# Altium schematic sheet MCU025B_Connectors.SchDoc
size 431 x 279 mm; PageSetup: Record=PageOptions|CenterHorizontal=True|CenterVertical=True|PrintScale=1.00|XCorrection=1.00|YCorrection=1.00|PrintKind=0|BorderSize=5000000|LeftOffset=0|BottomOffset=0|Orientation=2|PaperLength=1000|PaperWidth=1000|Scale=100|PaperSource=15|PrintQuality=600|MediaType=1|DitherType=10|PaperKind=Letter|PrintScaleMode=1; Organization: ORGANIZATION; Address1: ADDRESS 1; Address2: ADDRESS 2; Address3: ADDRESS 3; Address4: ADDRESS 4; Revision: -; ENG_APP_DATE: --/--/--; DSN_APP_DATE: --/--/--; CHK_APP_DATE: --/--/--
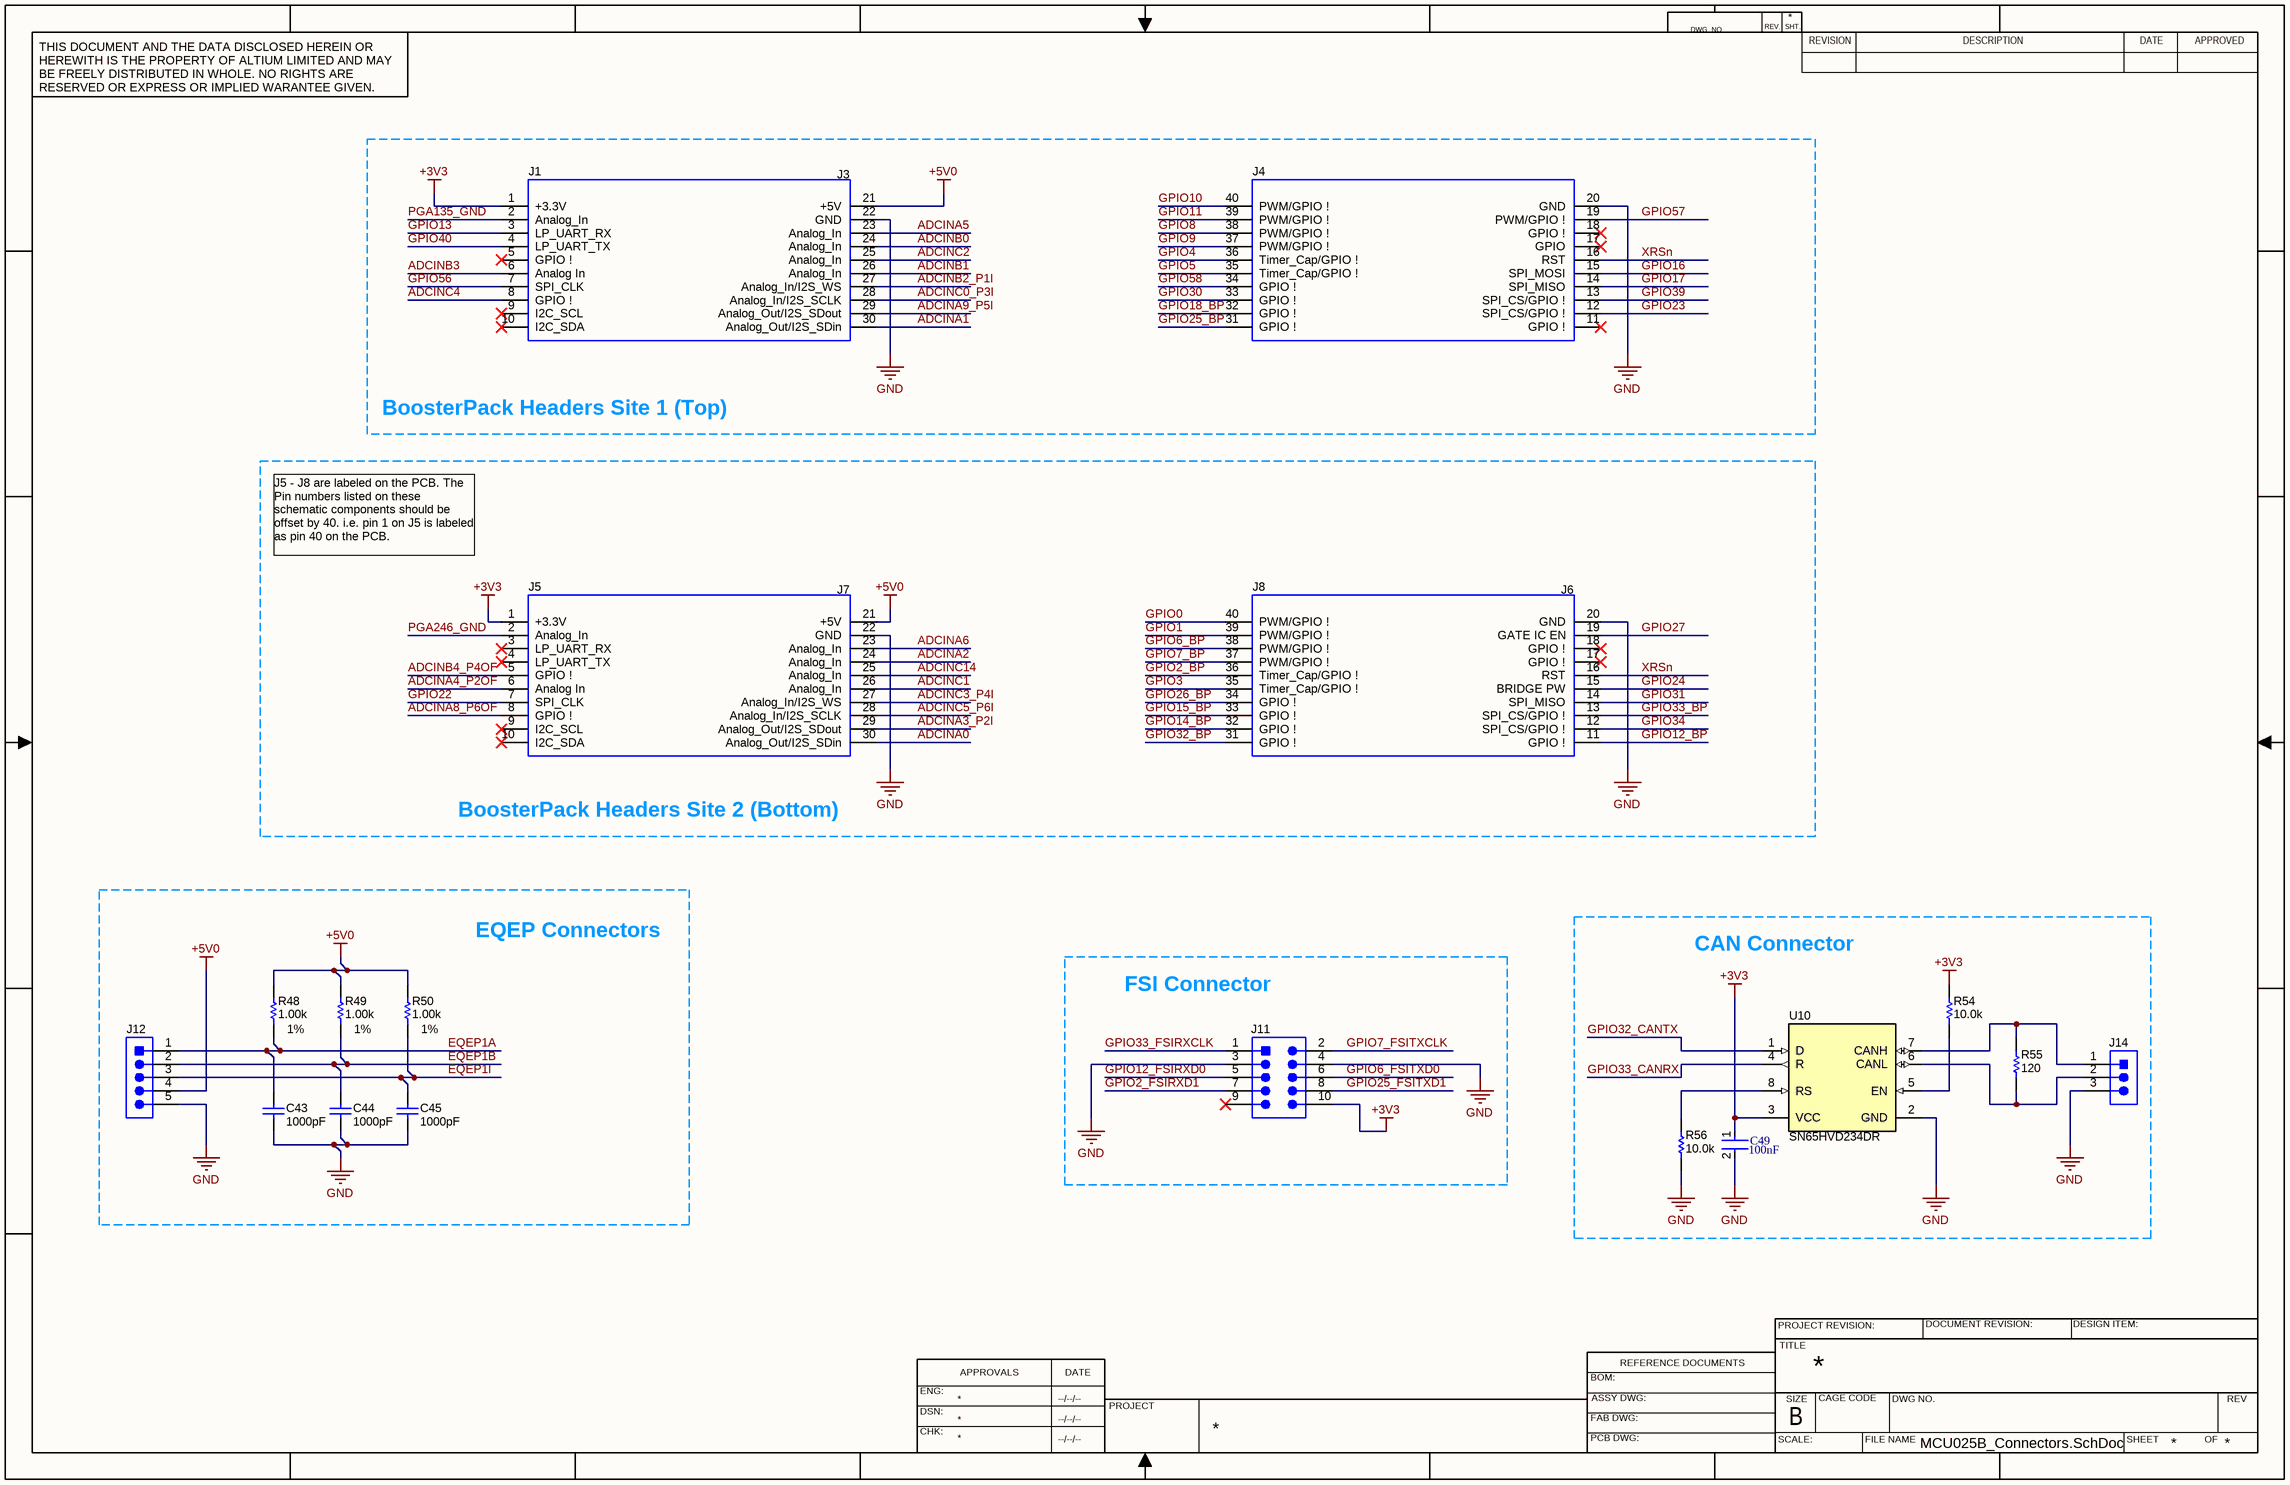
[diagram p0: MCU025B_Connectors.SchDoc]

## Parts
C43  ValueDisplayed: 1000pF  [0402]  (hidden comment: GRM155R71H102KA01D)
C44  ValueDisplayed: 1000pF  [0402]  (hidden comment: GRM155R71H102KA01D)
C45  ValueDisplayed: 1000pF  [0402]  (hidden comment: GRM155R71H102KA01D)
C49  Capacitance: 100nF  [FP-CL10-IPC_C]  (hidden comment: CL10B104KA8NFNC)
J1  SSQ-110-03-T-D  [BoosterPack_40pin_J1J3]  (value not drawn)
J4  SSQ-110-03-T-D  [BoosterPack_40pin_J2J4]  (value not drawn)
J5  SSQ-110-03-T-D  [BoosterPack_40pin_J1J3]  (value not drawn)
J8  SSQ-110-03-T-D  [BoosterPack_40pin_J2J4]  (value not drawn)
J11  TSW-105-07-G-D  [TSW-105-07-G-D]  (value not drawn)
J12  TSW-105-07-G-S  [TSW-105-07-X-S]  (value not drawn)
J14  61300311121  [WURTH_61300311121]  (value not drawn)
R48  ValueDisplayed: 1.00k  Value1: 1%  [0402]  (hidden comment: CRCW04021K00FKED)
R49  ValueDisplayed: 1.00k  Value1: 1%  [0402]  (hidden comment: CRCW04021K00FKED)
R50  ValueDisplayed: 1.00k  Value1: 1%  [0402]  (hidden comment: CRCW04021K00FKED)
R54  ValueDisplayed: 10.0k  [0402]  (hidden comment: CRCW040210K0FKED)
R55  ValueDisplayed: 120  [0603]  (hidden comment: RC0603FR-07120RL)
R56  ValueDisplayed: 10.0k  [0402]  (hidden comment: CRCW040210K0FKED)
U10  SN65HVD234DR  [D0008A_L]

## Nets
+3V3: C49.1 J1.1(+3.3V) J5.1(+3.3V) J11.10 R54.2 U10.3(VCC)
+5V0: J1.21(+5V) J5.21(+5V) J12.4 R48.2 R49.2 R50.2
GND: C43.2 C44.2 C45.2 C49.2 J1.22(GND) J4.20(GND) J5.22(GND) J8.20(GND) J11.3 J11.4 J12.5 J14.3 R56.1 U10.2(GND)
ADCINA0: J5.30(Analog_Out/I2S_SDin)
ADCINA1: J1.30(Analog_Out/I2S_SDin)
ADCINA2: J5.24(Analog_In)
ADCINA3_P2I: J5.29(Analog_Out/I2S_SDout)
ADCINA4_P2OF: J5.6(Analog_In)
ADCINA5: J1.23(Analog_In)
ADCINA6: J5.23(Analog_In)
ADCINA8_P6OF: J5.8(GPIO_!)
ADCINA9_P5I: J1.29(Analog_Out/I2S_SDout)
ADCINB0: J1.24(Analog_In)
ADCINB1: J1.26(Analog_In)
ADCINB2_P1I: J1.27(Analog_In/I2S_WS)
ADCINB3: J1.6(Analog_In)
ADCINB4_P4OF: J5.5(GPIO_!)
ADCINC0_P3I: J1.28(Analog_In/I2S_SCLK)
ADCINC1: J5.26(Analog_In)
ADCINC2: J1.25(Analog_In)
ADCINC3_P4I: J5.27(Analog_In/I2S_WS)
ADCINC4: J1.8(GPIO_!)
ADCINC5_P6I: J5.28(Analog_In/I2S_SCLK)
ADCINC14: J5.25(Analog_In)
EQEP1A: C43.1 J12.1 R48.1
EQEP1B: C44.1 J12.2 R49.1
EQEP1I: C45.1 J12.3 R50.1
GPIO0: J8.40(PWM/GPIO_!)
GPIO1: J8.39(PWM/GPIO_!)
GPIO2_BP: J8.36(Timer_Cap/GPIO_!)
GPIO2_FSIRXD1: J11.7
GPIO3: J8.35(Timer_Cap/GPIO_!)
GPIO4: J4.36(Timer_Cap/GPIO_!)
GPIO5: J4.35(Timer_Cap/GPIO_!)
GPIO6_BP: J8.38(PWM/GPIO_!)
GPIO6_FSITXD0: J11.6
GPIO7_BP: J8.37(PWM/GPIO_!)
GPIO7_FSITXCLK: J11.2
GPIO8: J4.38(PWM/GPIO_!)
GPIO9: J4.37(PWM/GPIO_!)
GPIO10: J4.40(PWM/GPIO_!)
GPIO11: J4.39(PWM/GPIO_!)
GPIO12_BP: J8.11(GPIO_!)
GPIO12_FSIRXD0: J11.5
GPIO13: J1.3(LP_UART_RX)
GPIO14_BP: J8.32(GPIO_!)
GPIO15_BP: J8.33(GPIO_!)
GPIO16: J4.15(SPI_MOSI)
GPIO17: J4.14(SPI_MISO)
GPIO18_BP: J4.32(GPIO_!)
GPIO22: J5.7(SPI_CLK)
GPIO23: J4.12(SPI_CS/GPIO_!)
GPIO24: J8.15(BRIDGE_PW)
GPIO25_BP: J4.31(GPIO_!)
GPIO25_FSITXD1: J11.8
GPIO26_BP: J8.34(GPIO_!)
GPIO27: J8.19(GATE_IC_EN)
GPIO30: J4.33(GPIO_!)
GPIO31: J8.14(SPI_MISO)
GPIO32_BP: J8.31(GPIO_!)
GPIO32_CANTX: U10.1(D)
GPIO33_BP: J8.13(SPI_CS/GPIO_!)
GPIO33_CANRX: U10.4(R)
GPIO33_FSIRXCLK: J11.1
GPIO34: J8.12(SPI_CS/GPIO_!)
GPIO39: J4.13(SPI_CS/GPIO_!)
GPIO40: J1.4(LP_UART_TX)
GPIO56: J1.7(SPI_CLK)
GPIO57: J4.19(PWM/GPIO_!)
GPIO58: J4.34(GPIO_!)
PGA135_GND: J1.2(Analog_In)
PGA246_GND: J5.2(Analog_In)
XRSn: J4.16(RST) J8.16(RST)
NetJ14_1: J14.1 R55.2 U10.7(CANH)
NetJ14_2: J14.2 R55.1 U10.6(CANL)
NetR54_1: R54.1 U10.5(EN)
NetR56_2: R56.2 U10.8(RS)

Not connected (* = marked no-connect by the designer): J1 5(GPIO_!)* 9(I2C_SCL)* 10(I2C_SDA)*; J4 11(GPIO_!)* 17(GPIO)* 18(GPIO_!)*; J5 3(LP_UART_RX)* 4(LP_UART_TX)* 9(I2C_SCL)* 10(I2C_SDA)*; J8 17(GPIO_!)* 18(GPIO_!)*; J11 9*

## Notes on the sheet
- (near J1) J3
- BoosterPack Headers Site 1 (Top)
- J5 - J8 are labeled on the PCB. The Pin numbers listed on these schematic components should be offset by 40. i.e. pin 1 on J5 is labeled as pin 40 on the PCB.
- (near J5) J7
- (near J8) J6
- BoosterPack Headers Site 2 (Bottom)
- EQEP Connectors
- CAN Connector
- FSI Connector
- DWG. NO.
- REV.
- SHT.
- THIS DOCUMENT AND THE DATA DISCLOSED HEREIN OR HEREWITH IS THE PROPERTY OF ALTIUM LIMITED AND MAY BE FREELY DISTRIBUTED IN WHOLE. NO RIGHTS ARE RESERVED OR EXPRESS OR IMPLIED WARANTEE GIVEN.
- REVISION
- DESCRIPTION
- DATE
- APPROVED
- APPROVALS
- REFERENCE DOCUMENTS
- PROJECT REVISION:
- TITLE
- DOCUMENT REVISION:
- DESIGN ITEM:
- ENG:
- DSN:
- CHK:
- PROJECT
- BOM:
- FAB DWG:
- PCB DWG:
- ASSY DWG:
- SCALE:
- SIZE
- B
- CAGE CODE
- FILE NAME
- DWG NO.
- SHEET
- OF
- REV

## Library data of the parts
C43-C45 = CMP-0006673-2: CAP, CERM, 1000 pF, 50 V, +/- 10%, X7R, 0402; Manufacturer: MuRata; Polarized: N; Value: 1000pF; U/M: EA; Cap_F: 1nF; Value1: Unknown; VDC_V: 50V; TaMin_C: -55°C; TaMax_C: 125°C; SizeArea_mm2: 0.5; SizeAreaWB_mm2: 3; SizeX_mm: 1; SizeZ_mm: 0.6; AEC Category: Q200; CompType: Capacitor; PartNumber: GRM155R71H102KA01D; PackageReference: 0402; RoHS: Y; Tolerance_%: 10%; Value2: 50V; MountType: SMT; Technology: Ceramic; TempCo: X7R; Cap_Case: 0402; SizeY_mm: 0.5; Published: 2008-06-19; Publisher: Texas Instruments; LatestRevisionDate: 2017-03-09; ComponentLink1Description: Datasheet link; ComponentLink1URL: http://search.murata.co.jp/Ceramy/PnsearchViewAction.do?HnOFG=ON&HnNFG=ON&SEL_CNT=50&sLang=en&sKey=GRM155R71H102KA01D&x=9&y=9&search=startwith; Supplier 1: Digi-Key; Supplier Part Number 1: 490-1303-1-ND; Supplier 2: Newark; Supplier Part Number 2: 14T3283; Supplier 3: Mouser; Supplier Part Number 3: 81-GRM36X102K50; AEC Qualified: ?
C49 = CMP-13271-001423-1: Cap Ceramic 100nF 25V X7R ±10% Pad SMD 0603 +125°C T/R; Depth: 0.8mm; Tolerance: 10%; Case Code (Imperial): 0603; Max Operating Temperature: 125°C; Min Operating Temperature: -55°C; Dielectric: X7R; Width: 0.031inch; Thickness: 0.035inch; Height: 0.8mm; Length: 1.6mm; Mount: Surface Mount; Voltage Rating: 25V; Case Code (Metric): 1608; Case/Package: 0603; Radiation Hardening: No; Packaging: Tape and Reel
J1 J5 = CMP-0003837-2: Receptacle, 2.54mm, 10x2, Tin, TH; Manufacturer: Samtec; Alternate Manufacturer: Major League Electronics; Alternate PartNumber: CRD-081413-A-G; Note: Booster Pack 40 pin J1 and J3; Green_Lifecycle: Active; Green_REACh: Incomplete; CompType: Receptacle; PartNumber: SSQ-110-03-T-D; RoHS: Y; PackageReference: 10x2 Receptacle; MountType: TH; ComponentLink1Description: Datasheet Link; ComponentLink1URL: https://www.samtec.com/ftppub/cpdf/SSQ-1XX-XX-XXX-X-XX-XXX-XX-X-MKT.pdf; Supplier 1: Digi-Key; Supplier Part Number 1: SAM1204-10-ND; Supplier 2: Newark; Supplier Part Number 2: 11P8392; Green_EU RoHS-2: Passed; Green_EU RoHS: Passed
J4 J8 = CMP-0078266-2: Receptacle, 2.54mm, 10x2, Tin, TH; Manufacturer: Samtec; Alternate Manufacturer: Major League Electronics; Alternate PartNumber: CRD-081413-A-G; Note: Booster Pack 40 pin J2 and J4; Green_Lifecycle: Active; Green_REACh: Incomplete; CompType: Receptacle; PartNumber: SSQ-110-03-T-D; RoHS: Y; PackageReference: 10x2 Receptacle; MountType: TH; ComponentLink1Description: Datasheet Link; Supplier 1: Digi-Key; Supplier Part Number 1: SAM1204-10-ND; Green_EU RoHS: Passed; Green_EU RoHS-2: Passed; ComponentLink1URL: https://www.samtec.com/ftppub/cpdf/SSQ-1XX-XX-XXX-X-XX-XXX-XX-X-MKT.pdf; Supplier 2: Newark; Supplier Part Number 2: 11P8392
J11 = CMP-0075410-2: Header, 100mil, 5x2, Gold, TH; Manufacturer: Samtec; Pitch_mm: 2.54; Cert_VDE: N; Gender: Male; Cert_CSA: Y; Voltage_V: 550V; Green_REACh: Passed; Current_A: 6.3A; Green_Lifecycle: Active; Row_Count: 2; ComponentLink1Description: Datasheet URL; RoHS: Y; Supplier 1: Digi-Key; Cert_UL: Y; Orientation: Vertical; Green_EU RoHS: Passed; PackageReference: 5x2 Header; Color: Black; PartNumber: TSW-105-07-G-D; PinCount: 10; ContactFinish: Gold; Cert_CULUS: N; Shrouded: N; ClassName: Header; RowSpacing_mm: 2.54; ComponentLink1URL: http://samtec.com/ftppub/pdf/TSW_TH.PDF; CompType: Header; MountType: TH; Supplier Part Number 1: SAM1028-05-ND; Green_EU RoHS-2: Passed
J12 = CMP-0075411-1: Header, 100mil, 5x1, Gold, TH; Manufacturer: Samtec; Pitch_mm: 2.54; Cert_VDE: N; Gender: Male; Cert_CSA: Y; Voltage_V: 550V; Green_REACh: Passed; Current_A: 6.3A; CT: False; Green_Lifecycle: Active; Row_Count: 1; CNHeader: True; ComponentLink1Description: Datasheet URL; RoHS: Y; Supplier 1: Digi-Key; Cert_UL: Y; Orientation: Vertical; Green_EU RoHS: Passed; PackageReference: 5x1 Header; Color: Black; PartNumber: TSW-105-07-G-S; PinCount: 5; Publisher: Texas Instruments; ContactFinish: Gold; Cert_CULUS: N; Shrouded: N; ClassName: Header; ComponentLink1URL: http://samtec.com/ftppub/pdf/TSW_TH.PDF; LatestRevisionDate: 2017-07-12; CompType: Header; MountType: TH; Supplier Part Number 1: SAM1029-05-ND; Green_EU RoHS-2: Passed
J14 = CMP-0054796-1: Header, 2.54 mm, 3x1, Gold, TH; Manufacturer: Wurth Elektronik; Green_Lifecycle: Active; Green_REACh: Passed; CNHeader: TRUE; CT: FALSE; PartNumber: 61300311121; PackageReference: Header, 2.54mm, 3x1, TH; ClassName: Header; CompType: Header; RoHS: Y; MountType: TH; ComponentLink1Description: Datasheet URL; ComponentLink1URL: http://katalog.we-online.de/em/datasheet/6130xx11121.pdf; Publisher: Texas Instruments; LatestRevisionDate: 26/05/2017; Supplier 1: Digi-Key; Supplier Part Number 1: 732-5316-ND; Supplier 2: Newark; Supplier Part Number 2: 20X0950; Supplier 3: Farnell; Supplier Part Number 3: 356154; Green_EU RoHS: Passed; Green_EU RoHS-2: Incomplete
R48-R50 = CMP-0026071-3: RES, 1.00 k, 1%, 0.063 W, AEC-Q200 Grade 0, 0402; Manufacturer: Vishay-Dale; Value: 1.00k; Res_ohm: 1k; Value_Code: 1k00; Power_W: 63mW; Value2: 0.063W; VDC_V: 50V; TempCo: 100 ppm/C; SizeArea_mm2: 0.5; SizeX_mm: 1; SizeZ_mm: 0.6; EIA_Code: E96; AEC Category: Q200; AEC Qualified: Y; AEC Grade: 0; CompType: Resistor; PartNumber: CRCW04021K00FKED; PackageReference: 0402; RoHS: E; Tolerance_%: 1%; MountType: SMT; Technology: Thick Film; SizeY_mm: 0.5; ComponentLink1Description: Datasheet link; ComponentLink1URL: http://www.vishay.com/docs/20035/dcrcwe3.pdf; Supplier 1: Digi-Key; Supplier Part Number 1: 541-1.00KLCT-ND; Supplier 2: Newark; Supplier Part Number 2: 52K6545; Supplier 3: Mouser; Supplier Part Number 3: 71-CRCW0402-1.0K-E3
R54 R56 = CMP-0025958-3: RES, 10.0 k, 1%, 0.063 W, AEC-Q200 Grade 0, 0402; Manufacturer: Vishay-Dale; Value: 10.0k; Res_ohm: 10k; Value_Code: 10k0; Power_W: 63mW; Value2: 0.063W; VDC_V: 50V; TempCo: 100 ppm/C; SizeArea_mm2: 0.5; SizeX_mm: 1; SizeZ_mm: 0.6; EIA_Code: E96; AEC Category: Q200; AEC Qualified: Y; AEC Grade: 0; CompType: Resistor; PartNumber: CRCW040210K0FKED; PackageReference: 0402; RoHS: E; Tolerance_%: 1%; Value1: 1%; MountType: SMT; Technology: Thick Film; SizeY_mm: 0.5; ComponentLink1Description: Datasheet link; ComponentLink1URL: http://www.vishay.com/docs/20035/dcrcwe3.pdf; Supplier 1: Digi-Key; Supplier Part Number 1: 541-10.0KLCT-ND; Supplier 2: Newark; Supplier Part Number 2: 52K6595; Supplier 3: Mouser; Supplier Part Number 3: 71-CRCW0402-10K-E3
R55 = CMP-0022769-3: RES, 120, 1%, 0.1 W, 0603; Manufacturer: Yageo America; Value: 120; Value_Code: 120R; Power_W: 100mW; Value2: 0.1W; VDC_V: 150V; TempCo: 200 ppm/C; SizeArea_mm2: 1.28; SizeX_mm: 1.6; SizeY_mm: 0.8; SizeZ_mm: 1; U/M: EA; AEC Category: Q200; CompType: Resistor; PartNumber: RC0603FR-07120RL; PackageReference: 0603; RoHS: Y; Res_ohm: 120; Tolerance_%: 1%; Value1: 1%; MountType: SMT; Technology: Thick Film; Published: 2008-06-26; Publisher: Texas Instruments; LatestRevisionDate: 2017-03-09; ComponentLink1Description: Datasheet link; ComponentLink1URL: http://www.yageo.com/pdf/Pu-RC0603_51_PbFree_L_2.pdf; Supplier 1: Digi-Key; Supplier Part Number 1: 311-120HRCT-ND; Supplier 2: Mouser; Supplier Part Number 2: 603-RC0603FR-07120RL; Supplier 3: Farnell; Supplier Part Number 3: 9238379; AEC Qualified: ?
U10 = CMP-0033355-1: 3.3V CAN Transceiver with Sleep Mode, 6 mA, -40 to 125 degC, 8-pin SOIC (D), Green (RoHS & no Sb/Br); Manufacturer: Texas Instruments; Drivers Per Package: 1; Bus Fault Voltage(V): +/-30; Transient Pulse Protection(V): -100 to 100; ICC(Max)(mA): 6; Supply Voltage(s)(V): 3.3; Rating: Catalog; DatasheetVersion: SLLS557F; PackageVersion: revM, Jun-2011; PackageReference: D0008A; PackageDescription: 8-Pin Plastic Small Outline Integrated Circuit, 4.9 x 3.9 mm, Pitch 1.27 mm Pitch; Eco-Plan: Green (RoHS & no Sb/Br); SubFamily: CAN; Receivers Per Package: 1; Isolated: No; Low Power Mode: Sleep; Footprint: PCA82C250, excludes pin5; PartNumber: SN65HVD234DR; Code_JEDEC: MS-012AA; ComponentLink1Description: Datasheet; ComponentLink1URL: http://www.ti.com/general/docs/lit/getliterature.tsp?genericPartNumber=SN65HVD234&fileType=pdf; Mounting Technology: Surface Mount